# Altium schematic sheet AlarmShield.SchDoc
size A4
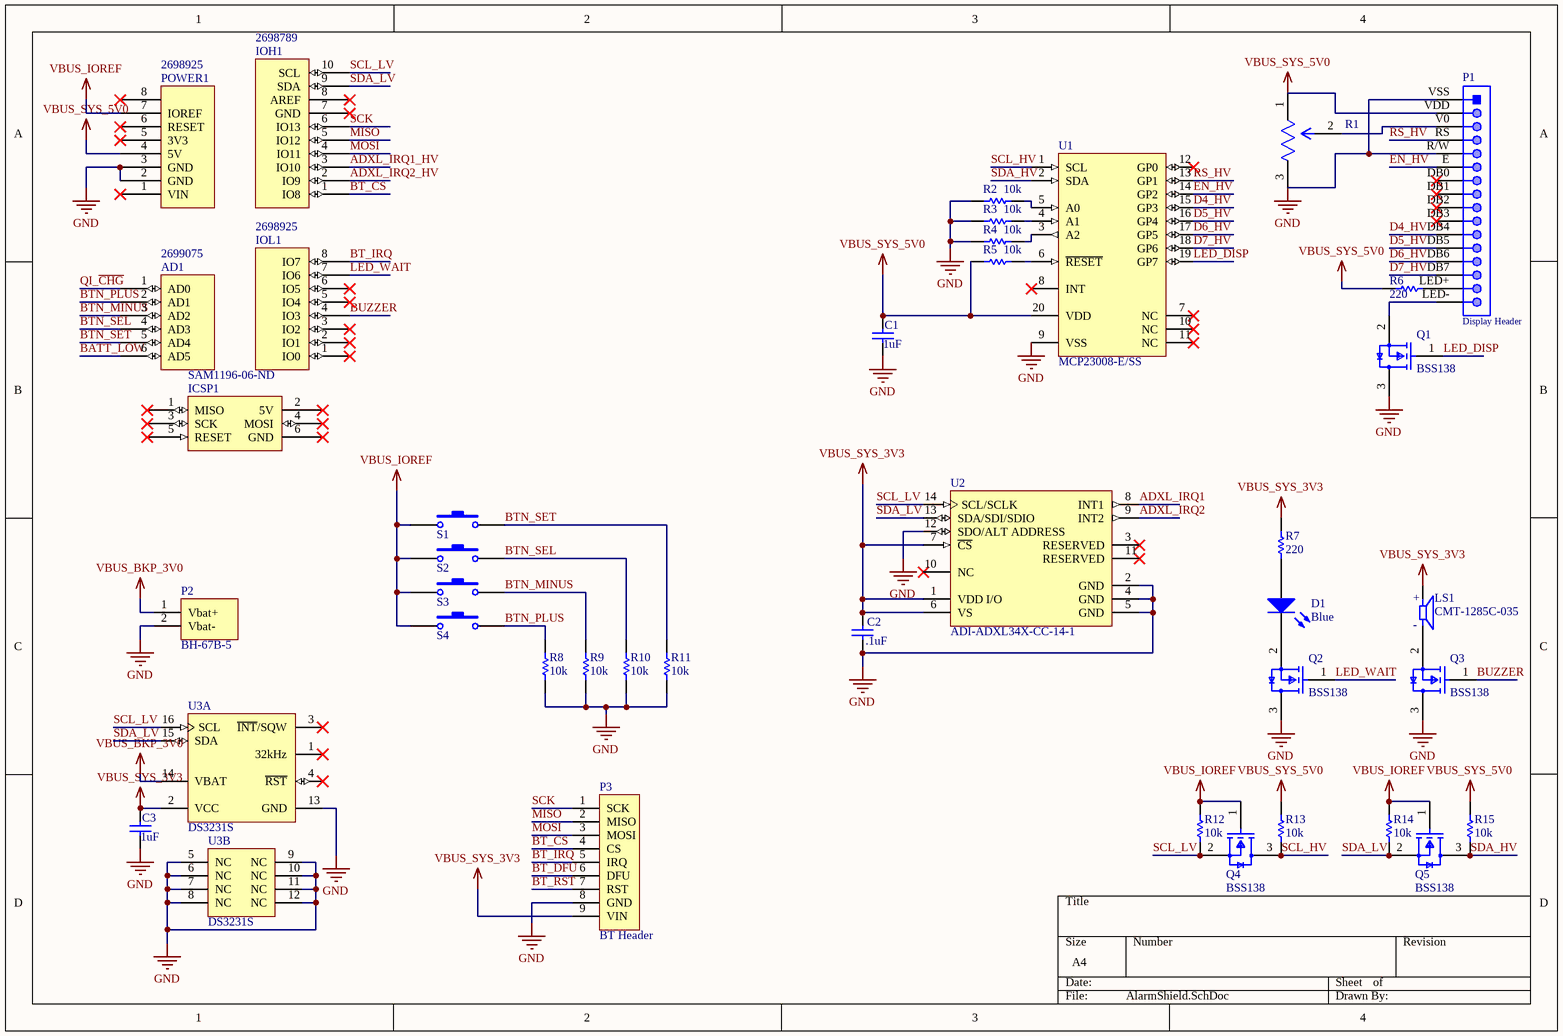
[diagram p0: AlarmShield.SchDoc]

## Parts
AD1  Supplier Part Number 4: 2699075  [Header 6x1 8.5mm]  (hidden comment: AD)
C1  1uF  [0805]
C2  .1uF  [0805]
C3  1uF  [0805]
D1  Blue  [1206_A_LED]
ICSP1  Supplier Part Number 5: SAM1196-06-ND  [ICSP]  (hidden comment: ICSP)
IOH1  Supplier Part Number 3: 2698789  [Header 10x1 8.5mm]  (hidden comment: IOH)
IOL1  Supplier Part Number 4: 2698925  [Header 8x1 8.5mm]  (hidden comment: IOL)
LS1  CMT-1285C-035  [CUI_CMT-1285C-035]
P1  Display Header  [61301611121]
P2  BH-67B-5  [PCBComponent_1]
P3  BT Header  [HDR1X9]
POWER1  Supplier Part Number 4: 2698925  [Header 8x1 8.5mm]  (hidden comment: POWER_UNO)
Q1  BSS138  [FP-318-08-IPC_B]
Q2  BSS138  [FP-318-08-IPC_B]
Q3  BSS138  [FP-318-08-IPC_B]
Q4  BSS138  [FP-318-08-IPC_B]
Q5  BSS138  [FP-318-08-IPC_B]
R1  100k  [FP-3386T-MFG]  (value not drawn)
R2  10k  [0805_RES_HD]
R3  10k  [0805_RES_HD]
R4  10k  [0805_RES_HD]
R5  10k  [0805_RES_HD]
R6  220  [0805_RES_HD]
R7  220  [0805_RES_HD]
R8  10k  [0805_RES_HD]
R9  10k  [0805_RES_HD]
R10  10k  [0805_RES_HD]
R11  10k  [0805_RES_HD]
R12  10k  [0805_RES_HD]
R13  10k  [0805_RES_HD]
R14  10k  [0805_RES_HD]
R15  10k  [0805_RES_HD]
S1  KSC221J  [ITT Cannon KSC2 Series]  (value not drawn)
S2  KSC221J  [ITT Cannon KSC2 Series]  (value not drawn)
S3  KSC221J  [ITT Cannon KSC2 Series]  (value not drawn)
S4  KSC221J  [ITT Cannon KSC2 Series]  (value not drawn)
U1  MCP23008-E/SS  [SSOP-SS20_N]
U2  ADI-ADXL34X-CC-14-1  [ADXL]
U3  DS3231S  [W16-H2_L]  (parts A,B of 2)

## Nets
GND: C1.2 C2.2 C3.2 P1.R/W P1.VSS P2.2(Vbat-) P3.8(GND) POWER1.2(GND) POWER1.3(GND) Q1.3(D) Q2.3(D) Q3.3(D) R1.3(CW) R2.2 R3.2 R4.2 R8.1 R9.1 R10.1 R11.1 U1.9(VSS) U2.2(GND) U2.4(GND) U2.5(GND) U2.12(SDO/ALT_ADDRESS) U3.5(NC) U3.6(NC) U3.7(NC) U3.8(NC) U3.9(NC) U3.10(NC) U3.11(NC) U3.12(NC) U3.13(GND)
VBUS_BKP_3V0: P2.1(Vbat+) U3.14(VBAT)
VBUS_IOREF: POWER1.7(IOREF) Q4.1(G) Q5.1(G) R12.1 R14.1 S1.1 S2.1 S3.1 S4.1
VBUS_SYS_3V3: C2.1 C3.1 LS1.P P3.9(VIN) R7.2 U2.1(VDD_I/O) U2.6(VS) U2.7(~{CS}) U3.2(VCC)
VBUS_SYS_5V0: C1.1 P1.VDD POWER1.4(5V) R1.1(CCW) R5.2 R6.1 R13.1 R15.1 U1.20(VDD)
ADXL_IRQ1: U2.8(INT1)
ADXL_IRQ1_HV: IOH1.3(IO10)
ADXL_IRQ2: U2.9(INT2)
ADXL_IRQ2_HV: IOH1.2(IO9)
BATT_LOW: AD1.6(AD5)
BT_CS: IOH1.1(IO8) P3.4(CS)
BT_DFU: P3.6(DFU)
BT_IRQ: IOL1.8(IO7) P3.5(IRQ)
BT_RST: P3.7(RST)
BTN_MINUS: AD1.3(AD2) R9.2 S3.2
BTN_PLUS: AD1.2(AD1) R8.2 S4.2
BTN_SEL: AD1.4(AD3) R10.2 S2.2
BTN_SET: AD1.5(AD4) R11.2 S1.2
BUZZER: IOL1.4(IO3) Q3.1(G)
D4_HV: P1.DB4 U1.15(GP3)
D5_HV: P1.DB5 U1.16(GP4)
D6_HV: P1.DB6 U1.17(GP5)
D7_HV: P1.DB7 U1.18(GP6)
EN_HV: P1.E U1.14(GP2)
LED_DISP: Q1.1(G) U1.19(GP7)
LED_WAIT: IOL1.7(IO6) Q2.1(G)
MISO: IOH1.5(IO12) P3.2(MISO)
MOSI: IOH1.4(IO11) P3.3(MOSI)
QI_~{CHG}: AD1.1(AD0)
RS_HV: P1.RS U1.13(GP1)
SCK: IOH1.6(IO13) P3.1(SCK)
SCL_HV: Q4.3(D) R13.2 U1.1(SCL)
SCL_LV: IOH1.10(SCL) Q4.2(S) R12.2 U2.14(SCL/SCLK) U3.16(SCL)
SDA_HV: Q5.3(D) R15.2 U1.2(SDA)
SDA_LV: IOH1.9(SDA) Q5.2(S) R14.2 U2.13(SDA/SDI/SDIO) U3.15(SDA)
NetD1_1: D1.1(K) Q2.2(S)
NetD1_2: D1.2(A) R7.1
NetLS1_N: LS1.N Q3.2(S)
NetP1_LED+: P1.LED+ R6.2
NetP1_LED-: P1.LED- Q1.2(S)
NetP1_V0: P1.V0 R1.2(WIPER)
NetR2_1: R2.1 U1.5(A0)
NetR3_1: R3.1 U1.4(A1)
NetR4_1: R4.1 U1.3(A2)
NetR5_1: R5.1 U1.6(~{RESET})

Not connected (* = marked no-connect by the designer): ICSP1 1(MISO)* 2(5V)* 3(SCK)* 4(MOSI)* 5(RESET)* 6(GND)*; IOH1 7(GND)* 8(AREF)*; IOL1 1(IO0)* 2(IO1)* 3(IO2)* 5(IO4)* 6(IO5)*; P1 DB0(7)* DB1(8)* DB2(9)* DB3(10)*; POWER1 1(VIN)* 5(3V3)* 6(RESET)* 8*; U1 7(NC)* 8(INT)* 10(NC)* 11(NC)* 12(GP0)*; U2 3(RESERVED)* 10(NC)* 11(RESERVED)*; U3 1(32kHz)* 3(~{INT}/SQW)* 4(~{RST})*

## Notes on the sheet
- (in symbol CMT-1285C-035) +; -

## Library data of the parts
C1-C3 = CC0805KRX7R9BB152: 1.5nF, 10%, 50V; Manufacturer 1: Yageo; GFUPartNo: CC0805KRX7R9BB152; Manufacturer Part Number 1: CC0805KRX7R9BB152; Part Type: SMT; PackageReference: 0805; Supplier 1: Digi-Key; Supplier Part Number 1: 311-1128-1-ND
D1 = WE-LED_K1A2-2_Local
LS1 = CMT-1285C-035: 12 mm, 3.5 Vo-p, 91 dB, Through Hole, Magnetic Audio Transducer Buzzer; MF: CUI Devices; Availability: Good; SnapEDA_Link: https://www.snapeda.com/parts/CMT-1285C-035/CUI%20Devices/view-part/2772240/?ref=snap; Arrow_Electronics-Purchase-URL: https://snapeda.com/shop?store=Arrow+Electronics&id=2772240; Price: None; Package: TO-220 CUI Inc.; MP: CMT-1285C-035; Mouser-Purchase-URL: https://snapeda.com/shop?store=Mouser&id=2772240; Value: *; CUI_purchase_URL: https://www.cuidevices.com/product/audio/buzzers/audio-transducers/cmt-1285c-035?utm_source=snapeda.com&utm_medium=referral&utm_campaign=snapedaBOM
P1 = CMP-1502-01095-1: THT Vertical Pin Header WR-PHD, Pitch 2.54 mm, Single Row, 16 pins; Manufacturer: Wurth Elektronik; Working Voltage: 250VAC; Withstanding Voltage: 500VAC; Gender: Male; Pitch: 2.54mm; Contact Resistance: 20mOhm; Rated Current: 3A; Pin Number: 16; Part Number: 61301611121; Manufacturer URL: http://www.we-online.de; Row Number: Single; Package Reference: 61301611121; Datasheet URL: https://katalog.we-online.de/em/datasheet/6130xx11121.pdf; Publisher: WurthElektronik; Operating Temperature: -40to105degC; Orientation: Vertical; Packaging: Bag; Mounting Technology: THT
P2 = BH-67B-5: BATTERY HOLDER CR 2032
P3 = Header 9: Header, 9-Pin; LatestRevisionDate: 17-Jul-2002; LatestRevisionNote: Re-released for DXP Platform.; Publisher: Altium Limited
Q1-Q5 = CMP-07173-000101-1: MOSFET N-CH 50V 220MA SOT-23; Turn-Off Delay Time: 20ns; Element Configuration: Single; Rds On Max: 3.5R; Gate to Source Voltage (Vgs): 20V; Threshold Voltage: 1.3V; Number of Elements: 1; Power Dissipation: 360mW; Rise Time: 9ns; Turn-On Delay Time: 2.5ns; Input Capacitance: 27pF; On-State Resistance: 6R; Lead Free: Lead Free; Length: 2.92mm; Width: 1.3mm; Drain to Source Breakdown Voltage: 50V; Min Operating Temperature: -55°C; REACH SVHC: No SVHC; Packaging: Tape and Reel; Radiation Hardening: No; Height: 0.93mm; Drain to Source Voltage (Vdss): 50V; Current Rating: 220mA; Voltage Rating (DC): 50V; Weight: 0.03g; Continuous Drain Current (ID): 220mA; Number of Pins: 3; Nominal Vgs: 1.3V; Max Power Dissipation: 360mW; Fall Time: 9ns; Drain to Source Resistance: 3.5R; Contact Plating: Tin; Case/Package: SOT-23; Package Quantity: 1; Dual Supply Voltage: 50V; Mount: Surface Mount; Termination: SMD/SMT; Max Operating Temperature: 150°C
R1 = 3386T_1_103TLF: Contrast Trim Potentiometer
R2-R15 = RC0805FR-07100RL: 50k Ohm ±1% 0.125W, 1/8W Surface Mount Resistor Thick Film ±100ppm/°C 0805; Manufacturer 1: Yageo; GFUPartNo: RC0805FR-07100RL; Manufacturer Part Number 1: RC0805FR-07100RL; Part Type: SMT; Supplier 1: Digi-Key; Supplier Part Number 1: 311-100CRCT-ND
S1-S4 = KSC221J: SWITCH TACT SILVER J-LEAD; Manufacturer 1: ITT Cannon; GFUPartNo: KSC221J; Manufacturer Part Number 1: KSC221J; Part Type: SMT; Supplier 1: Digi-Key; Supplier Part Number 1: 401-1758-1-ND
U1 = CMP-0186-00169-3: 8-Bit I/O Expander with Serial Interface, 20-Pin SSOP, Extended Temperature; PackageVersion: revBB, Aug-2009; Code_JEDEC: MO-150; ComponentLink3URL: http://www.microchip.com/stellent/groups/techpub_sg/documents/packagingspec/en012702.pdf; PackageReference: SSOP-SS20; ComponentLink2Description: Datasheet; ComponentLink1URL: http://www.microchip.com/; ComponentLink2URL: http://ww1.microchip.com/downloads/en/DeviceDoc/21919e.pdf; RevisionNote: Sch corrected.; PackageDescription: 20-Lead Plastic Shrink Small Outline (SS) - 5.3mm Body [SSOP]; ComponentLink1Description: Manufacturer URL; ComponentLink3Description: Package Specification; DatasheetVersion: revE, Aug-2007
U3 = CMP-0254-00244-1: Extremely Accurate I2C-Integrated Real-Time Clock/TCXO/Crystal, 16-Pin SO, 0 to 70 degC; Code_IPC: SOIC127P1030-16; ComponentLink2Description: Datasheet; ComponentLink1URL: http://www.maxim-ic.com; PackageDescription: 16-Pin Small-Outline IC, Wide (0.3in), 1.27 mm Pitch, SOIC (W); PackageReference: W16-H2; ComponentLink2URL: http://datasheets.maxim-ic.com/en/ds/DS3231.pdf; DatasheetVersion: Rev 8, Jul-2010; PackageVersion: revD, 2010; ComponentLink1Description: Manufacturer URL; ComponentLink3Description: Package Specification; Code_JEDEC: MS-013-AA; ComponentLink3URL: http://pdfserv.maxim-ic.com/package_dwgs/21-0042.PDF
AD1 = AD: Supplier 1: Arrow; Supplier Part Number 1: 2699089; Supplier 2: Digi-Key; Supplier Part Number 2: SAM1198-06-ND; Supplier 3: Arrow; Supplier Part Number 3: 2699088; Supplier 4: Arrow
ICSP1 = ICSP: Supplier 1: Arrow; Supplier Part Number 1: 2699117; Supplier 2: Arrow; Supplier Part Number 2: 2699116; Supplier 3: Digi-Key; Supplier Part Number 3: SAM1185-06-ND; Supplier 4: Arrow; Supplier Part Number 4: 2699091; Supplier 5: Digi-Key
IOH1 = IOH: Supplier 1: Arrow; Supplier Part Number 1: 2698803S4475693N1004; Supplier 2: Digi-Key; Supplier Part Number 2: SAM1198-10-ND; Supplier 3: Arrow
IOL1 = IOL: Supplier 1: Digi-Key; Supplier Part Number 1: SAM1198-08-ND; Supplier 2: Arrow; Supplier Part Number 2: 2698939; Supplier 3: Arrow; Supplier Part Number 3: 2698940; Supplier 4: Arrow
POWER1 = POWER_UNO: Supplier 1: Digi-Key; Supplier Part Number 1: SAM1198-08-ND; Supplier 2: Arrow; Supplier Part Number 2: 2698939; Supplier 3: Arrow; Supplier Part Number 3: 2698940; Supplier 4: Arrow